# Altium schematic sheet Nguyen_ly.SchDoc
size A4
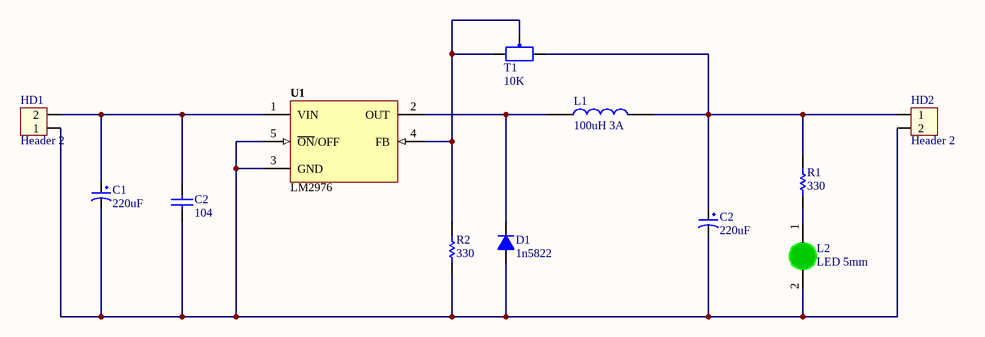
[diagram p0: Nguyen_ly.SchDoc]

## Parts
(Parts that share a designator on the sheet are numbered #1, #2 ... from top to bottom, then left to right.)
C1  220uF  [tu hoa 10mm]
C2#1  104  [tu gom]
C2#2  220uF  [tu hoa 10mm]
D1  1n5822  [DIODE 1A]
HD1  Header 2  [HED2]
HD2  Header 2  [HED2]
L1  100uH 3A  [CUON CAM 100uH3A]
L2  LED 5mm  [LED-5MM-Green]
R1  value 330  [R1/4W]  (hidden comment: Res1)
R2  value 330  [R1/4W]  (hidden comment: Res1)
T1  10K  [Bien Tro Vi Chinh Dung]
U1  LM2976  [DIP5]

## Nets
NetC1_1: C1.1 C2#1.1 HD1.2 U1.1(VIN)
NetC1_2: C1.2 C2#1.2 C2#2.2 D1.1(A) HD1.1 HD2.2 L2.2(K) R2.2 U1.3(GND) U1.5(~{ON}/OFF)
NetC2#2_1: C2#2.1 HD2.1 L1.2 R1.1 T1.3
NetD1_2: D1.2(K) L1.1 U1.2(OUT)
NetL2_1: L2.1(A) R1.2
NetR2_1: R2.1 T1.1 T1.2 U1.4(FB)

## Library data of the parts
C1 C2#2 = Tu Hoa 220uF 50V 10x14: Cắm; Don_Vi: Con; So_Chan: 2; Ten_Linh_Kien: Tụ Hóa 220uF 50V; Ma_Hang: MH006873; Chung_Loai: Cắm; Kieu_Chan: *
C2#1 = Tu gom 104 50V: Cắm; So_Chan: 2; Ten_Linh_Kien: Tụ gốm 104 100nF 50V; Don_Vi: Con; Ma_Hang: MH004761; Chung_Loai: Cắm; Kieu_Chan: *
D1 = Diode 1N4007: Cắm; Ten_Linh_Kien: Diode 1N4007 1A (DIP); Don_Vi: Con; Ma_Hang: MH001063; Ghi Chu: *; Kieu_Chan: *; Chung_Loai: Cắm
HD1 HD2 = Hed2: Header 2 (Green); Value: Header 2
L1 = CUON CAM 100uH DIP: Dán; Don_Vi: Con; Ma_Hang: MH002209; Ten_Linh_Kien: Cuộn Cảm 100uH 3A 8x10MM; Chung_Loai: Dán; Ghi Chu: *; Kieu Chan: *
L2 = LED 5mm Xanh La: Cắm; Don_Vi: Con; Ma_Hang: MH008969; Ten_Linh_Kien: LED 5MM Phủ Xanh (1000c); Ghi_Chu: *; Kieu_Chan: *; Chung_Loai: Cắm
R1 R2 = Res1_1: Resistor; Manufacturer: Generic Components; Class: Passive; Published: 08/06/2000; Publisher: Altium Hobart Technology Centre; SubClass: Resistor
T1 = Bien Tro Tinh Chinh 10K Dung: Cắm; Ma_Hang: MH003232; Ten_Linh_Kien: Biến Trở VR 103-10K 3296W; Don_Vi: Con; Kieu_Chan: *; Chung_Loai: Cắm; Ghi_Chu: *
U1 = LM2596: Max Input Voltage: 12 V; Max Output Current: 3 (6.0 peak) A; Max Output Voltage: mV; Category: IC-Power; Min Input Voltage: mV; Min Output Voltage: mV; Mounting Technology: Surface Mount; Status: Unreleased; Supply Voltage: mV; Temperature Range: -40 to +125 degC